# EAGLE design Segger_JTAG (EAGLE 9.3.0)
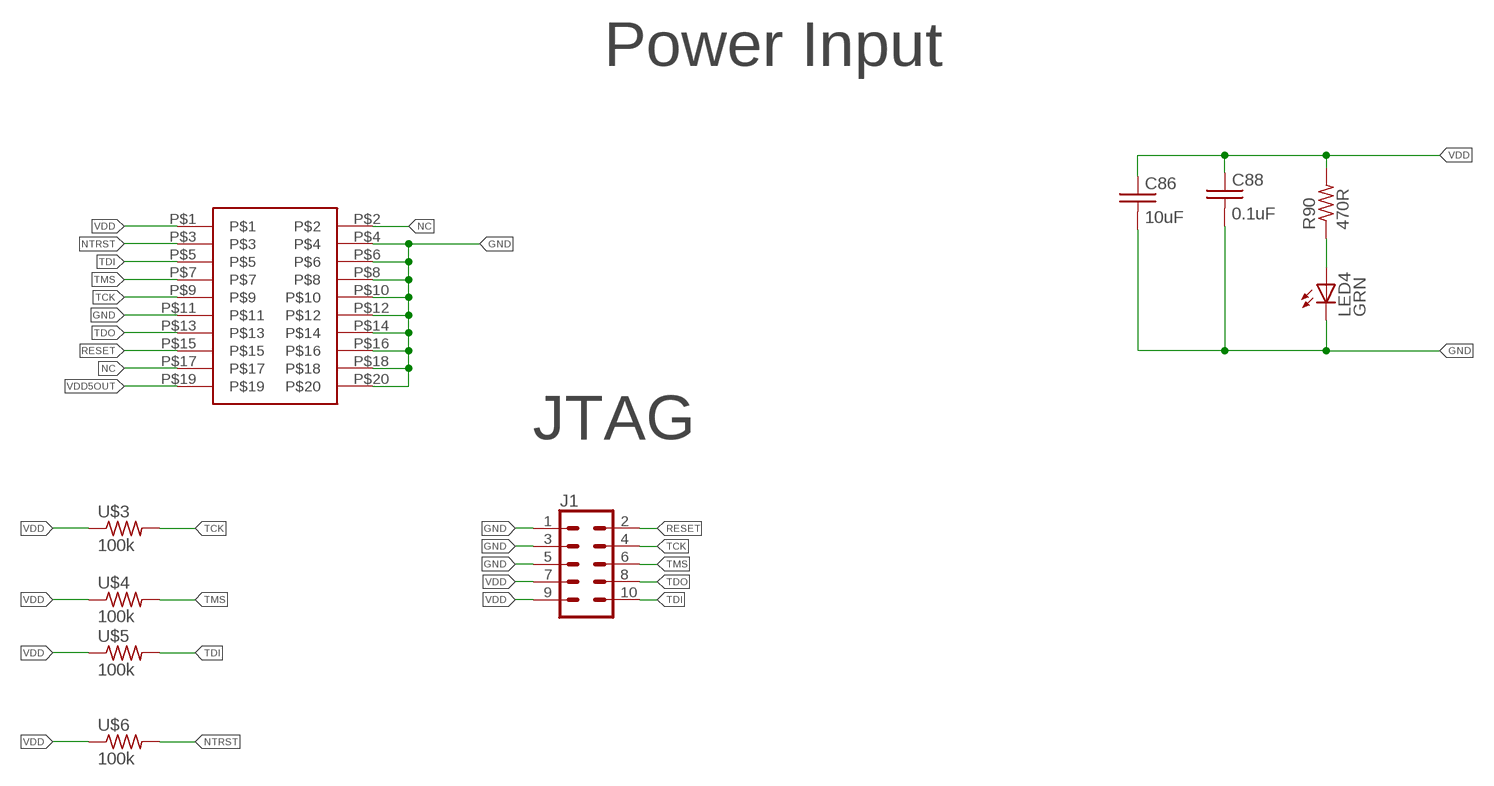
[diagram p0: schematic, sheet 1]

## Parts
C86  10uF  C_0805  [0805]
C88  0.1uF  C_0805  [0805]
J1  CONN_05X2SHD  [2X5-SHROUDED]
LED4  LED_0805_GREEN  [LED_0805_GREEN]
R90  470R  R_0805  [0805]
U$2  2_X_10_HEADER_GENERIC  [2_X_10_.1_INCH]
U$3  100k  R_0805  [0805]
U$4  100k  R_0805  [0805]
U$5  100k  R_0805  [0805]
U$6  100k  R_0805  [0805]

## Nets
GND: C86.2 C88.2 J1.1 J1.3 J1.5 LED4.C U$2.P$4 U$2.P$6 U$2.P$8 U$2.P$10 U$2.P$11 U$2.P$12 U$2.P$14 U$2.P$16 U$2.P$18 U$2.P$20
N$7: LED4.A R90.1
NC: U$2.P$2 U$2.P$17
NTRST: U$2.P$3 U$6.2
RESET: J1.2 U$2.P$15
TCK: J1.4 U$2.P$9 U$3.2
TDI: J1.10 U$2.P$5 U$5.2
TDO: J1.8 U$2.P$13
TMS: J1.6 U$2.P$7 U$4.2
VDD: C86.1 C88.1 J1.7 J1.9 R90.2 U$2.P$1 U$3.1 U$4.1 U$5.1 U$6.1
VDD5OUT: U$2.P$19

## Notes on the sheet
- Power Input
- JTAG

## Library data of the parts
C86 C88 = 3D_MIG_Controller:C_0805
J1 = 3D_MIG_Controller:CONN_05X2: Multi connection point. Often used as Generic Header-pin footprint for 0.1 inch spaced/style header connections For AVR SPI programming port, see special device with nice symbol: "AVR_SPI_PROG_5x2.dev" You can populate with any combo of single row headers, but if you'd like an exact match, check these: 2x5 AVR ICSP Male Header <https://www.sparkfun.com/products/778> (PRT-00778) 2x5 Pin Shrouded Header <https://www.sparkfun.com/products/8506> (PRT-08506) On any of the 0.1 inch spaced packages, you can populate with these: Break Away Headers - Straight <https://www.sparkfun.com/products/116> (PRT-00116) Break Away Male Headers - Right Angle <https://www.sparkfun.com/products/553> (PRT-00553) Female Headers <https://www.sparkfun.com/products/115> (PRT-00115) Break Away Headers - Machine Pin <https://www.sparkfun.com/products/117> (PRT-00117) Break Away Female Headers - Swiss Machine Pin <https://www.sparkfun.com/products/743> (PRT-00743) Special note: the shrouded connector mates well with our 5x2 ribbon cables: 2x5 Pin IDC Ribbon Cable <https://www.sparkfun.com/products/8535> (PRT-08535); PROD_ID: CONN-08671; SF_ID: PRT-08506
LED4 = 3D_MIG_Controller:LED_0805_GREEN
R90 U$3-U$6 = 3D_MIG_Controller:R_0805
U$2 = 3D_MIG_Controller:2_X_10_HEADER_GENERIC

## Board
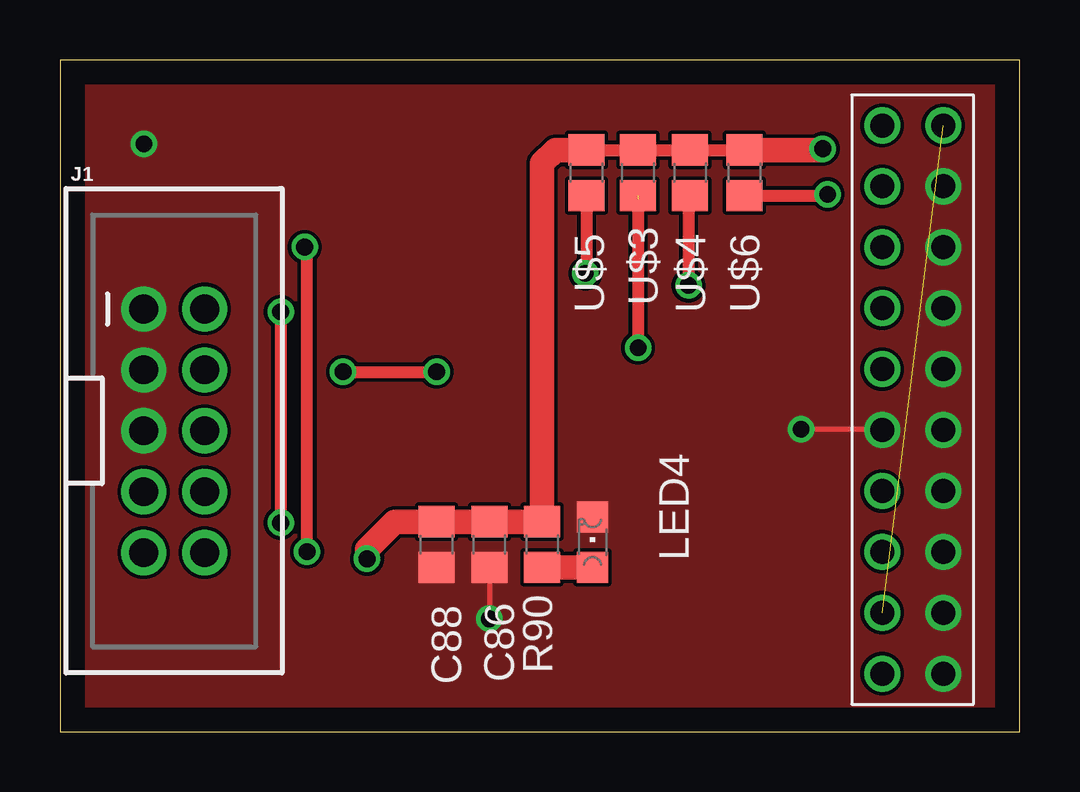
[diagram p1: board, top side]
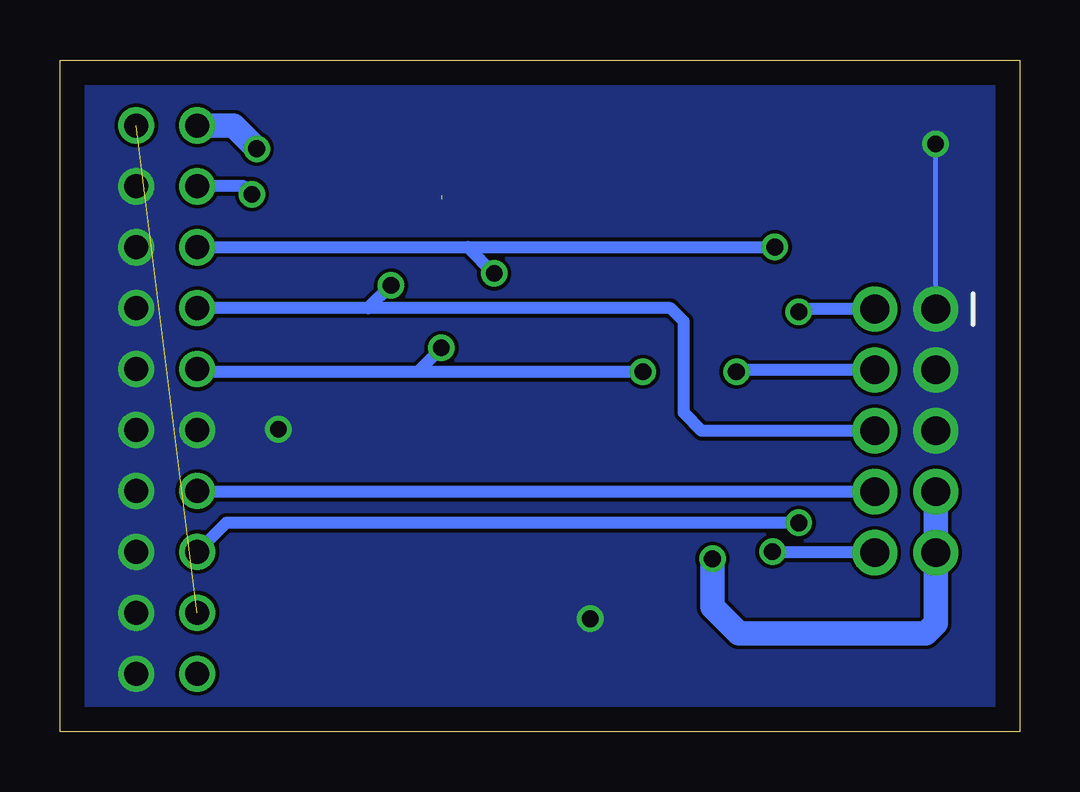
[diagram p2: board, bottom side, seen from below]

Size 40 x 28 mm. Coordinates in mm from the lower left corner, seen from the top.
Outline: 0,0 40,0 40,28 0,28 0,0
Copper layers (1*16): Top 0.035mm / dielectric 1.5mm / Bottom 0.035mm
Design rules "default": minimum track width 6mil, minimum drill 0.35mm, track to track 6mil, track to pad 6mil, pad to pad 6mil, via to via 6mil, smd to smd 6mil, copper to edge 40mil, drill to drill 6mil, minimum pad ring 10mil, minimum via ring 8mil, stop-mask expansion 4mil, vias tented up to drill 0mil, thermal gap 10mil

### Footprints (pad centres in the part's own frame; a part is rotated, then mirrored left to right if it is on the bottom)
0805 = smd 1.3 x 1.5: 1 -0.95,0; 2 0.95,0
2X5-SHROUDED = drill 1.2 pad 1.88: 1 -1.27,5.08; 2 1.27,5.08; 3 -1.27,2.54; 4 1.27,2.54; 5 -1.27,0; 6 1.27,0; 7 -1.27,-2.54; 8 1.27,-2.54; 9 -1.27,-5.08; 10 1.27,-5.08
LED_0805_GREEN = smd 1.3 x 1.3: A 0,-1.05; C 0,1.05
2_X_10_.1_INCH = drill 1: P$1 -11.43,-1.27; P$2 -11.43,1.27; P$3 -8.89,-1.27; P$4 -8.89,1.27; P$5 -6.35,-1.27; P$6 -6.35,1.27; P$7 -3.81,-1.27; P$8 -3.81,1.27; P$9 -1.27,-1.27; P$10 -1.27,1.27; P$11 1.27,-1.27; P$12 1.27,1.27; P$13 3.81,-1.27; P$14 3.81,1.27; P$15 6.35,-1.27; P$16 6.35,1.27; P$17 8.89,-1.27; P$18 8.89,1.27; P$19 11.43,-1.27; P$20 11.43,1.27

### Placement (x,y rotation side)
C86  17.9,7.8 270 top
C88  15.7,7.8 270 top
J1  4.76,12.54 0 top
LED4  22.2,7.9 0 top
R90  20.1,7.8 90 top
U$2  35.55,13.84 270 top
U$3  24.09,23.3 270 top
U$4  26.27,23.3 270 top
U$5  21.95,23.3 270 top
U$6  28.53,23.3 270 top

### Tracks (layer width: path | path; a pad name or v marks a point on that pad's centre or on a via)
GND  (via drill 0.7)
  Top 0.2: C86.2 v17.9,4.7 | U$2.P$11 34.28,12.6 v30.9,12.6
  Bottom 0.2: J1.1 v3.49,24.5 v3.5,24.5
  pour Bottom (no thermals): 0.1,27.9 39.9,27.9 39.9,0.1 0.1,0.1
  pour Top (no thermals): 0.1,27.9 39.9,27.9 39.9,0.1 0.1,0.1
N$7
  Top 1.016: R90.1 LED4.A
NC  (1 unrouted)
NTRST  (via drill 0.7)
  Top 0.508: U$6.2 31.95,22.35 v32,22.4
  Bottom 0.508: v32,22.4 32.33,22.73 U$2.P$3
RESET  (via drill 0.7)
  Top 0.508: v9.2,17.5 v9.2,8.7
  Bottom 0.508: J1.2 9.08,17.62 v9.2,17.5 | v9.2,8.7 33.07,8.7 U$2.P$15
TCK  (via drill 0.7)  (1 unrouted)
  Top 0.508: 24.09,22.19 24.09,22.75 | v11.8,15 v15.7,15 | U$3.2 v24.09,16.01 v24.1,16
  Bottom 0.508: U$2.P$9 34.17,15 25.1,15 | J1.4 11.72,15.08 v11.8,15 | v15.7,15 25.1,15 | v24.1,16 25.1,15
TDI  (via drill 0.7)
  Top 0.508: v10.3,7.5 10.3,20.1 v10.2,20.2 | U$5.2 21.95,19.15 v21.9,19.1
  Bottom 0.508: J1.10 10.26,7.46 v10.3,7.5 | 23,20.2 U$2.P$5 | 23,20.2 v10.2,20.2 | v21.9,19.1 23,20.2
TDO
  Bottom 0.508: J1.8 34.25,10 U$2.P$13
TMS  (via drill 0.7)
  Top 0.508: U$4.2 26.2,22.28 v26.2,18.6
  Bottom 0.508: J1.6 13.24,12.54 14,13.3 14,17.1 14.55,17.65 27.15,17.65 | 27.15,17.65 U$2.P$7 | v26.2,18.6 27.15,17.65
VDD  (via drill 0.7)
  Top 0.508: U$5.1 U$3.1 U$4.1 U$6.1
  Top 1.016: v12.8,7.2 12.8,7.6 13.95,8.75 C88.1 C86.1 R90.2 20.1,23.7 20.65,24.25 U$5.1 | U$6.1 31.75,24.25 v31.8,24.3
  Bottom 1.016: v12.8,7.2 12.8,5.2 11.7,4.1 3.9,4.1 3.49,4.51 J1.9 J1.7 | U$2.P$1 32.77,25.27 v31.8,24.3